# EAGLE design alfred_pulse (EAGLE 7.3.0)
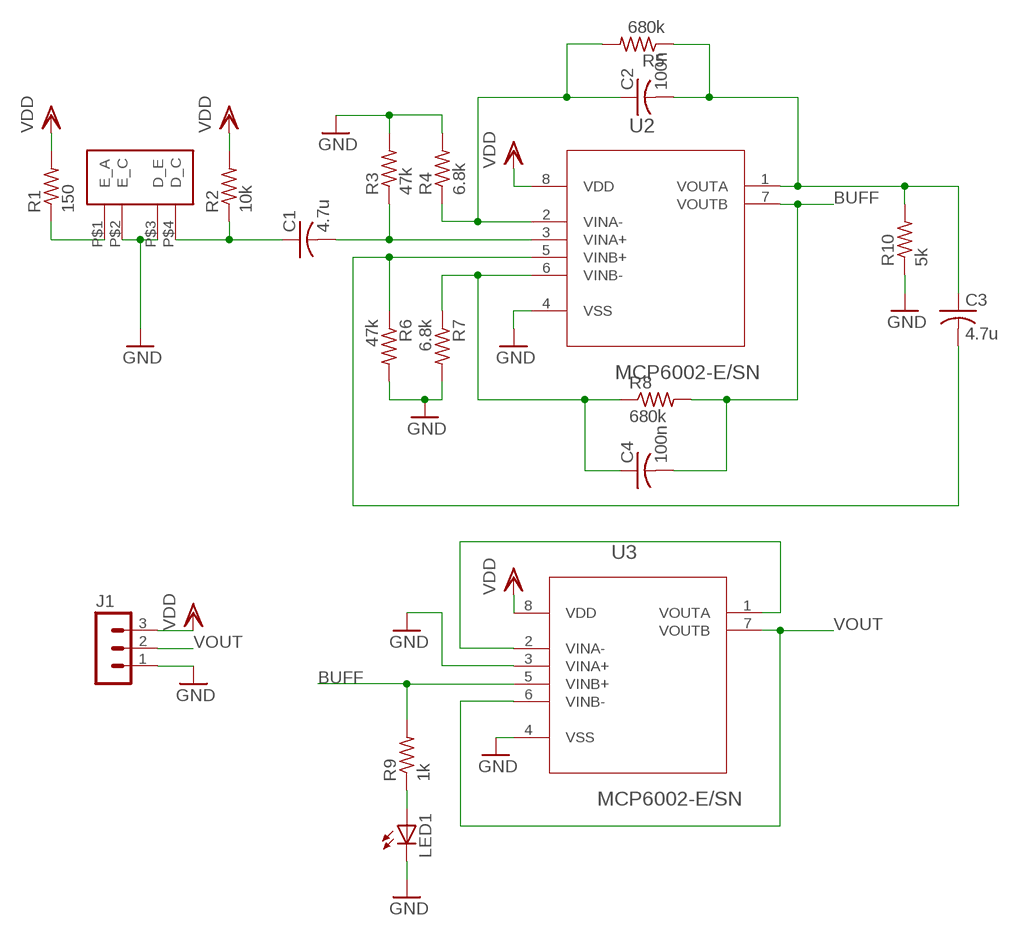
[diagram p0: schematic, sheet 1]

## Parts
C1  4.7u  C-USC0603  [C0603]
C2  100n  C-USC0603  [C0603]
C3  4.7u  C-USC0603  [C0603]
C4  100n  C-USC0603  [C0603]
J1  MA03-1  [MA03-1]
LED1  LEDCHIPLED_1206  [CHIPLED_1206]
R1  150  R-US_R0603  [R0603]
R2  10k  R-US_R0603  [R0603]
R3  47k  R-US_R0603  [R0603]
R4  6.8k  R-US_R0603  [R0603]
R5  680k  R-US_R0603  [R0603]
R6  47k  R-US_R0603  [R0603]
R7  6.8k  R-US_R0603  [R0603]
R8  680k  R-US_R0603  [R0603]
R9  1k  R-US_R0603  [R0603]
R10  5k  R-US_R0603  [R0603]
U2  MCP6002-E/SN  [SOIC127P600X175-8N]
U3  MCP6002-E/SN  [SOIC127P600X175-8N]
U$1  TCRT1001  [TCRT1001]

## Nets
BUFF: C4.2 R8.2 R9.2 U2.7(VOUTB) U3.5(VINB+)
GND: J1.1 LED1.C R3.2 R4.2 R6.2 R7.2 R10.1 U2.4(VSS) U3.3(VINA+) U3.4(VSS) U$1.P$2(E_C) U$1.P$3(D_E)
N$1: R1.1 U$1.P$1(E_A)
N$2: C1.1 R2.1 U$1.P$4(D_C)
N$3: C1.2 R3.1 U2.3(VINA+)
N$7: C3.2 R6.1 U2.5(VINB+)
N$8: LED1.A R9.1
N$9: C4.1 R7.1 R8.1 U2.6(VINB-)
N$10: C2.2 C3.1 R5.1 R10.2 U2.1(VOUTA)
N$11: C2.1 R4.1 R5.2 U2.2(VINA-)
N$13: U3.1(VOUTA) U3.2(VINA-)
VDD: J1.3 R1.2 R2.2 U2.8(VDD) U3.8(VDD)
VOUT: J1.2 U3.6(VINB-) U3.7(VOUTB)

## Library data of the parts
C1-C4 = adafruit:C-US: CAPACITOR, American symbol
J1 = con-lstb:MA03-1: PIN HEADER; OC_FARNELL: unknown; OC_NEWARK: unknown
LED1 = adafruit:LED: LED OSRAM: - CHIPLED LG R971, LG N971, LY N971, LG Q971, LY Q971, LO R971, LY R971 LH N974, LH R974 LS Q976, LO Q976, LY Q976 LO Q996 - Hyper CHIPLED LW Q18S LB Q993, LB Q99A, LB R99A - SideLED LS A670, LO A670, LY A670, LG A670, LP A670 LB A673, LV A673, LT A673, LW A673 LH A674 LY A675 LS A676, LA A676, LO A676, LY A676, LW A676 LS A679, LY A679, LG A679 - Hyper Micro SIDELED® LS Y876, LA Y876, LO Y876, LY Y876 LT Y87S - SmartLED LW L88C, LW L88S LB L89C, LB L89S, LG L890 LS L89K, LO L89K, LY L89K LS L896, LA L896, LO L896, LY L896 - TOPLED LS T670, LO T670, LY T670, LG T670, LP T670 LSG T670, LSP T670, LSY T670, LOP T670, LYG T670 LG T671, LOG T671, LSG T671 LB T673, LV T673, LT T673, LW T673 LH T674 LS T676, LA T676, LO T676, LY T676, LB T676, LH T676, LSB T676, LW T676 LB T67C, LV T67C, LT T67C, LS T67K, LO T67K, LY T67K, LW E67C LS E67B, LA E67B, LO E67B, LY E67B, LB E67C, LV E67C, LT E67C LW T67C LS T679, LY T679, LG T679 LS T770, LO T770, LY T770, LG T770, LP T770 LB T773, LV T773, LT T773, LW T773 LH T774 LS E675, LA E675, LY E675, LS T675 LS T776, LA T776, LO T776, LY T776, LB T776 LHGB T686 LT T68C, LB T68C - Hyper Mini TOPLED® LB M676 - Mini TOPLED Santana® LG M470 LS M47K, LO M47K, LY M47K Source: http://www.osram.convergy.de/
R1-R10 = adafruit:R-US_: RESISTOR, American symbol
U2 U3 = Microchip_By_element14_Batch_1:MCP6002-E/SN: Low-Power Op Amp; DESCRIPTION: Low-Power Op Amp; MPN: MCP6002-E/SN; OC_FARNELL: 1332118; OC_NEWARK: 34M7473; PACKAGE: SOIC-8; SUPPLIER: Microchip
U$1 = tcrt1001:TCRT1001: TCRT1001 Library file for TCRT1001: Relective Optical Sensor with Transistor Output

## Board
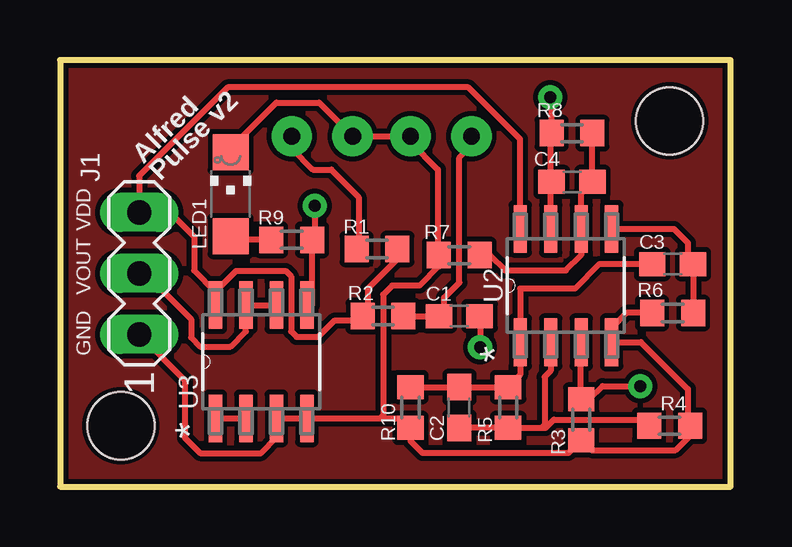
[diagram p1: board, top side]
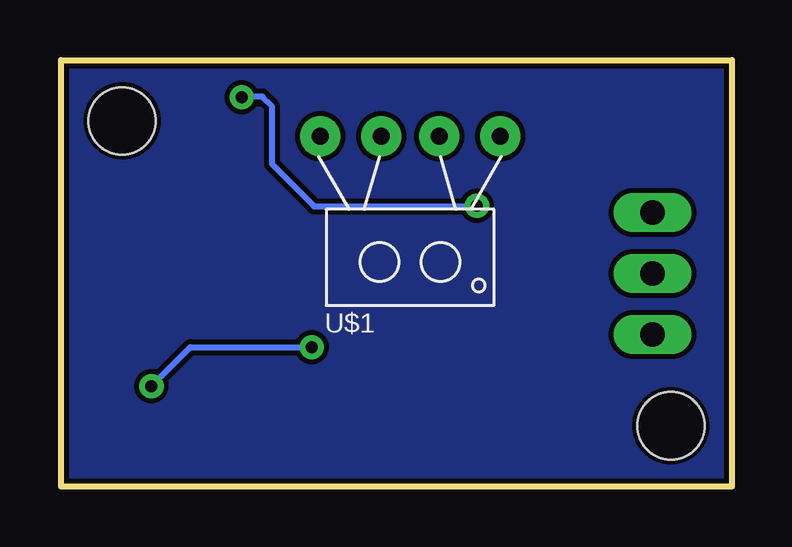
[diagram p2: board, bottom side, seen from below]

Size 27.99 x 17.78 mm. Coordinates in mm from the lower left corner, seen from the top.
Outline: 27.94,0 27.99,0 27.99,17.77 0,17.77 0,0
Outline: 0,0 27.94,0
Outline: 27.94,0 27.94,17.78 0,17.78 0,0
Copper layers (1*16): Top 0.035mm / dielectric 1.5mm / Bottom 0.035mm
Design rules "SparkFun": minimum track width 8mil, minimum drill 20mil, track to track 8mil, track to pad 8mil, pad to pad 8mil, via to via 8mil, smd to smd 8mil, copper to edge 8mil, drill to drill 8mil, minimum pad ring 12mil, minimum via ring 10mil, stop-mask expansion 4mil, vias tented up to drill 20mil, thermal gap 10mil
Holes 2.8 mm at 2.54,2.54 25.4,15.24

### Footprints (pad centres in the part's own frame; a part is rotated, then mirrored left to right if it is on the bottom)
C0603 = smd 1.1 x 1: 1 -0.85,0; 2 0.85,0
MA03-1 = drill 1.016 long: 1 -2.54,0; 2 0,0; 3 2.54,0
CHIPLED_1206 = smd 1.5 x 1.5: A 0,-1.75; C 0,1.75
R0603 = smd 1 x 1.1: 1 -0.85,0; 2 0.85,0
SOIC127P600X175-8N = smd 1.981 x 0.559: 1 -2.362,1.905; 2 -2.362,0.635; 3 -2.362,-0.635; 4 -2.362,-1.905; 5 2.362,-1.905; 6 2.362,-0.635; 7 2.362,0.635; 8 2.362,1.905
TCRT1001 = drill 0.7 pad 1.676: P$1 -0.254,-3.048; P$2 2.286,-3.048; P$3 4.699,-3.048; P$4 7.239,-3.048

### Placement (x,y rotation side)
C1  16.64,7.11 0 top
C2  16.64,3.3 90 top
C3  25.53,9.27 0 top
C4  21.34,12.7 180 top
J1  3.3,8.89 90 top
LED1  7.11,12.19 0 top
R1  13.21,9.91 0 top
R2  13.46,7.11 180 top
R3  21.72,2.79 270 top
R4  25.4,2.54 0 top
R5  18.67,3.3 270 top
R6  25.53,7.24 180 top
R7  16.64,9.65 180 top
R8  21.34,14.73 180 top
R9  9.65,10.29 0 top
R10  14.61,3.3 90 top
U2  21.08,8.38 90 top
U3  8.38,5.21 90 top
U$1  9.91,11.56 180 bottom

### Tracks (layer width: path | path; a pad name or v marks a point on that pad's centre or on a via)
BUFF  (via drill 0.5)
  Top 0.254: U3.5 10.5,7.57 R9.2 | R9.2 10.5,10.71 | v10.62,11.71 10.62,10.4 R9.2 | U2.7 20.45,12.66 | 20.45,12.66 C4.2 | 20.45,12.66 20.45,14.69 R8.2 20.49,16.17 v20.42,16.23
  Bottom 0.254: v10.62,11.71 10.64,11.68 17.4,11.68 19.15,13.44 19.15,15.85 19.56,16.26 20.4,16.26 v20.42,16.23
GND
  Top 0.254: LED1.C 7.11,14.1 9.02,16 10.79,16 U$1.P$2 U$1.P$3 14.61,14.35 15.75,13.21 15.75,9.69 R7.2 15.79,9.18 14.99,8.38 13.84,8.38 13.46,8 13.46,2.97 13.34,2.85 | 13.34,2.85 U3.4 U3.3 9.02,2.03 8.38,1.4 5.84,1.4 5.21,2.03 5.21,4.45 J1.1 | 13.34,2.85 14.21,2.85 R10.1 14.61,1.91 15.11,1.4 21.17,1.4 R3.2 22.14,1.52 25.65,1.52 26.25,2.12 R4.2 26.16,2.63 26.16,4.06 24.21,6.02 U2.4 22.99,6.6 23.62,7.24 R6.2
N$1
  Top 0.254: U$1.P$1 9.65,14.1 10.54,13.21 11.3,13.21 12.45,12.06 12.45,9.99 R1.1
N$2
  Top 0.254: R2.1 C1.1 16,7.11 16,7.87 16.64,8.51 16.64,13.72 17.14,14.22 U$1.P$4
N$3  (via drill 0.5)
  Top 0.254: U2.3 21.68,5.98 21.68,4.24 | C1.2 17.5,7.11 v17.5,5.82 | 21.68,4.24 21.68,4.03 | 21.68,4.24 R3.1 22.06,3.64 22.61,4.19 v24.18,4.19
  Bottom 0.254: v17.5,5.82 22.55,5.82 v24.18,4.19
N$7
  Top 0.254: U2.5 25.58,10.74 26.16,10.16 26.16,9.49 C3.2 R6.1
N$8
  Top 0.254: R9.1 7.11,10.29 LED1.A
N$9
  Top 0.254: R7.1 17.91,9.65 18.54,9.02 21.08,9.02 21.72,9.65 U2.6 21.72,12.23 C4.1 R8.1
N$10
  Top 0.254: R10.2 C2.2 R5.1 19.18,4.66 U2.1 19.18,8.26 21.46,8.26 22.48,9.27 C3.1
N$11
  Top 0.254: C2.1 R5.2 20.07,2.45 | U2.2 20.45,4.83 20.19,4.57 20.19,2.58 20.07,2.45 | 24.42,2.41 R4.1 24.3,2.79 20.57,2.79 20.23,2.45 20.07,2.45
N$13
  Top 0.254: U3.1 U3.2
N$18
  pour Top: 0,0 27.94,0 27.94,17.78 0,17.78 0,0.25
N$19
  pour Bottom: 0,0 27.94,0 27.94,17.78 0,17.78
VDD
  Top 0.254: R1.2 14.1,9.65 14.1,9.53 12.83,8.26 12.83,7.33 R2.2 | 12.83,6.69 R2.2 | R2.2 12.6,6.93 11.46,6.93 10.77,6.25 9.86,6.25 9.63,6.48 9.63,8.76 9.4,8.99 7.34,8.99 6.48,8.13 | U2.8 19.18,14.48 17.02,16.64 6.99,16.64 3.3,12.95 J1.3 3.3,11.3 4.7,11.3 5.59,10.41 5.59,9.02 6.48,8.13 | U3.8 6.48,8.13
VOUT
  Top 0.254: U3.6 U3.7 7.75,6.48 7.11,5.84 5.84,5.84 5.46,6.22 5.46,6.99 3.56,8.89 J1.2

### Text on the board
tPlace: Alfred / Pulse v2 | VDD | VOUT | GND